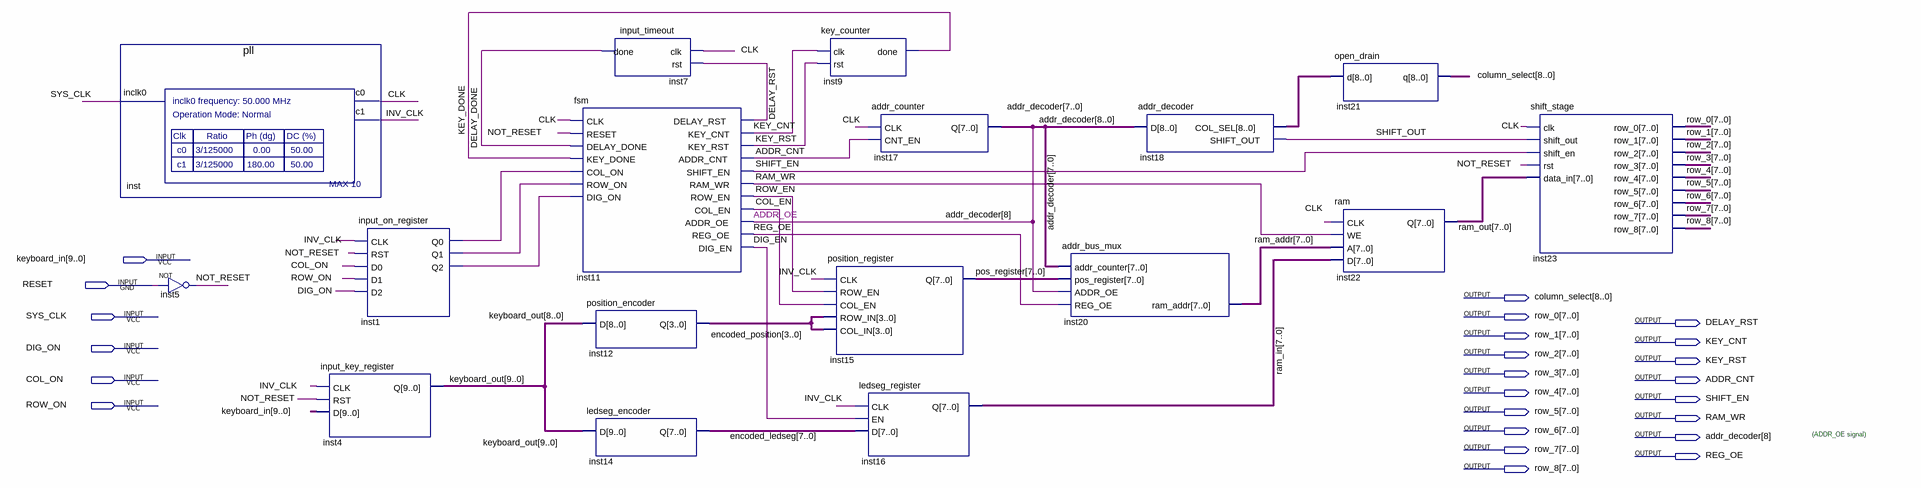
[diagram p0: schematic sheet]
// Quartus schematic debug_full_design.bdf as structural Verilog: 17 symbols, 24 pins
module debug_full_design (
  input  [9:0] keyboard_in,
  input  RESET,
  input  SYS_CLK,
  input  DIG_ON,
  input  COL_ON,
  input  ROW_ON,
  output [8:0] column_select,
  output [7:0] row_0,
  output DELAY_RST,
  output [7:0] row_1,
  output KEY_CNT,
  output [7:0] row_2,
  output KEY_RST,
  output [7:0] row_3,
  output ADDR_CNT,
  output [7:0] row_4,
  output SHIFT_EN,
  output [7:0] row_5,
  output RAM_WR,
  output [7:0] row_6,
  output [8:0] addr_decoder,
  output [7:0] row_7,
  output REG_OE,
  output [7:0] row_8
);

  wire CLK, COL_EN, DELAY_DONE, DIG_EN, inst1_q0, inst1_q1, inst1_q2, INV_CLK, KEY_DONE, NOT_RESET, ROW_EN,
       SHIFT_OUT;
  wire [3:0] encoded_position;
  wire [7:0] encoded_ledseg, pos_register, ram_addr, ram_in, ram_out;
  wire [8:0] inst18_col_sel;
  wire [9:0] keyboard_out;

  pll inst (.inclk0(SYS_CLK), .c0(CLK), .c1(INV_CLK));
  not inst5 (NOT_RESET, RESET);
  input_on_register inst1 (
    .CLK(INV_CLK), .RST(NOT_RESET), .D0(COL_ON), .D1(ROW_ON), .D2(DIG_ON), .Q0(inst1_q0), .Q1(inst1_q1),
    .Q2(inst1_q2));
  input_key_register inst4 (.CLK(INV_CLK), .RST(NOT_RESET), .D(keyboard_in), .Q(keyboard_out));
  input_timeout inst7 (.clk(CLK), .rst(DELAY_RST), .done(DELAY_DONE));
  fsm inst11 (
    .CLK(CLK), .RESET(NOT_RESET), .DELAY_DONE(DELAY_DONE), .KEY_DONE(KEY_DONE), .COL_ON(inst1_q0),
    .ROW_ON(inst1_q1), .DIG_ON(inst1_q2), .DELAY_RST(DELAY_RST), .KEY_CNT(KEY_CNT), .KEY_RST(KEY_RST),
    .ADDR_CNT(ADDR_CNT), .SHIFT_EN(SHIFT_EN), .RAM_WR(RAM_WR), .ROW_EN(ROW_EN), .COL_EN(COL_EN),
    .ADDR_OE(addr_decoder[8]), .REG_OE(REG_OE), .DIG_EN(DIG_EN));
  position_encoder inst12 (.D(keyboard_out[8:0]), .Q(encoded_position));
  ledseg_encoder inst14 (.D(keyboard_out), .Q(encoded_ledseg));
  key_counter inst9 (.clk(KEY_CNT), .rst(KEY_RST), .done(KEY_DONE));
  addr_counter inst17 (.CLK(CLK), .CNT_EN(ADDR_CNT), .Q(addr_decoder[7:0]));
  position_register inst15 (
    .CLK(INV_CLK), .ROW_EN(ROW_EN), .COL_EN(COL_EN), .ROW_IN(encoded_position), .COL_IN(encoded_position),
    .Q(pos_register));
  ledseg_register inst16 (.CLK(INV_CLK), .EN(DIG_EN), .D(encoded_ledseg), .Q(ram_in));
  addr_bus_mux inst20 (
    .addr_counter(addr_decoder[7:0]), .pos_register(pos_register), .ADDR_OE(addr_decoder[8]),
    .REG_OE(REG_OE), .ram_addr(ram_addr));
  addr_decoder inst18 (.D(addr_decoder), .COL_SEL(inst18_col_sel), .SHIFT_OUT(SHIFT_OUT));
  open_drain inst21 (.d(inst18_col_sel), .q(column_select));
  ram inst22 (.CLK(CLK), .WE(RAM_WR), .A(ram_addr), .D(ram_in), .Q(ram_out));
  shift_stage inst23 (
    .clk(CLK), .shift_out(SHIFT_OUT), .shift_en(SHIFT_EN), .rst(NOT_RESET), .data_in(ram_out), .row_0(row_0),
    .row_1(row_1), .row_2(row_2), .row_3(row_3), .row_4(row_4), .row_5(row_5), .row_6(row_6), .row_7(row_7),
    .row_8(row_8));

  // Notes on the sheet:
  //   ADDR_OE
  //   (ADDR_OE signal)
endmodule
